# Altium schematic sheet micro-circuit-ATMEGA64M1.SchDoc: ATMega32M1 Circuit
size A4; DrawnBy: Dylan Vogel; Organization: UTAT SS; Revision: 1.1
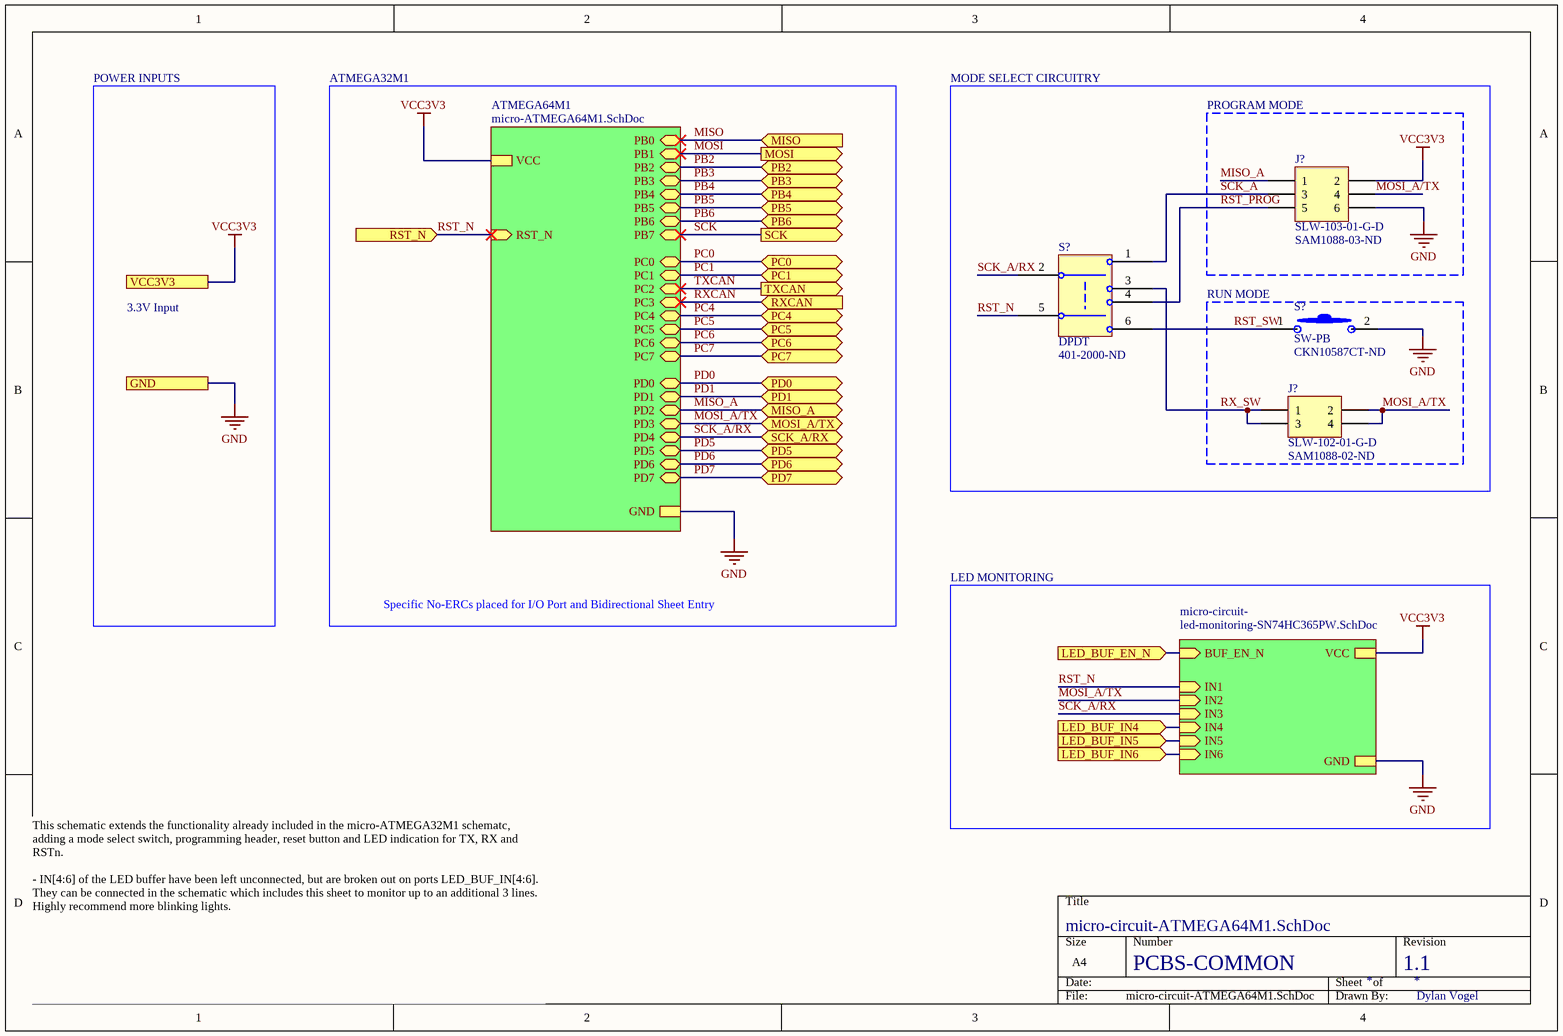
[diagram p0: micro-circuit-ATMEGA64M1.SchDoc]

## Parts
(Parts that share a designator on the sheet are numbered #1, #2 ... from top to bottom, then left to right.)
J?#1  SLW-103-01-G-D  Supplier Part Number 1: SAM1088-03-ND  [SLW-103-01-X-D]
J?#2  SLW-102-01-G-D  Supplier Part Number 1: SAM1088-02-ND  [SLW-102-01-X-D]
S?#1  DPDT  Supplier Part Number 1: 401-2000-ND  [JS202011AQN - Slide Switch]
S?#2  SW-PB  Supplier Part Number 1: CKN10587CT-ND  [PTS830GM140 SMTR LFS - Pushbutton]

## Blocks framed on the sheet
MODE SELECT CIRCUITRY: S?#1
PROGRAM MODE: J?#1
RUN MODE: J?#2 S?#2

## Sub-sheets
ATMEGA64M1 = micro-ATMEGA64M1.SchDoc: GND, PB7 (bidir), RST_N (in), VCC, PD2 (bidir), PC0 (bidir), PD1 (bidir), PD3 (bidir), PD0 (bidir), PC7 (bidir), PD5 (bidir), PC1 (bidir), PC6 (bidir), PB1 (bidir), PB6 (bidir), PC5 (bidir), PC2 (bidir), PB5 (bidir), PC3 (bidir), PD7 (bidir), PB4 (bidir), PB0 (bidir), PC4 (bidir), PD6 (bidir), PB2 (bidir), PB3 (bidir), PD4 (bidir)
micro-circuit- = led-monitoring-SN74HC365PW.SchDoc: IN4 (in), VCC, IN3 (in), IN1 (in), GND, IN2 (in), IN6 (in), IN5 (in), BUF_EN_N (in)  | LED1: GREEN LED; LED2: ORANGE LED; LED3: ORANGE LED

## Ports
GND, LED_BUF_EN_N (in), LED_BUF_IN4 (in), LED_BUF_IN5 (in), LED_BUF_IN6 (in), MISO (in), MISO_A (bidir), MOSI (out), MOSI_A/TX (bidir), PB2 (bidir), PB3 (bidir), PB4 (bidir), PB5 (bidir), PB6 (bidir), PC0 (bidir), PC1 (bidir), PC4 (bidir), PC5 (bidir), PC6 (bidir), PC7 (bidir), PD0 (bidir), PD1 (bidir), PD5 (bidir), PD6 (bidir), PD7 (bidir), RST_N (in), RXCAN (in), SCK (out), SCK_A/RX (bidir), TXCAN (out), VCC3V3

## Nets
GND: J?#1.6 S?#2.2 ; port GND, sheet micro-circuit-/GND, sheet ATMEGA64M1/GND
VCC3V3: J?#1.2 ; port VCC3V3, sheet micro-circuit-/VCC, sheet ATMEGA64M1/VCC
LED_BUF_EN_N: port LED_BUF_EN_N, sheet micro-circuit-/BUF_EN_N
LED_BUF_IN4: port LED_BUF_IN4, sheet micro-circuit-/IN4
LED_BUF_IN5: port LED_BUF_IN5, sheet micro-circuit-/IN5
LED_BUF_IN6: port LED_BUF_IN6, sheet micro-circuit-/IN6
MISO: port MISO, sheet ATMEGA64M1/PB0
MISO_A: J?#1.1 ; port MISO_A, sheet ATMEGA64M1/PD2
MOSI: port MOSI, sheet ATMEGA64M1/PB1
MOSI_A/TX: J?#1.4 J?#2.2 J?#2.4 ; port MOSI_A/TX, sheet micro-circuit-/IN2, sheet ATMEGA64M1/PD3
PB2: port PB2, sheet ATMEGA64M1/PB2
PB3: port PB3, sheet ATMEGA64M1/PB3
PB4: port PB4, sheet ATMEGA64M1/PB4
PB5: port PB5, sheet ATMEGA64M1/PB5
PB6: port PB6, sheet ATMEGA64M1/PB6
PC0: port PC0, sheet ATMEGA64M1/PC0
PC1: port PC1, sheet ATMEGA64M1/PC1
PC4: port PC4, sheet ATMEGA64M1/PC4
PC5: port PC5, sheet ATMEGA64M1/PC5
PC6: port PC6, sheet ATMEGA64M1/PC6
PC7: port PC7, sheet ATMEGA64M1/PC7
PD0: port PD0, sheet ATMEGA64M1/PD0
PD1: port PD1, sheet ATMEGA64M1/PD1
PD5: port PD5, sheet ATMEGA64M1/PD5
PD6: port PD6, sheet ATMEGA64M1/PD6
PD7: port PD7, sheet ATMEGA64M1/PD7
RST_N: S?#1.5(POLE2) ; port RST_N, sheet micro-circuit-/IN1, sheet ATMEGA64M1/RST_N
RST_PROG: J?#1.5 S?#1.4(POLE2A)
RST_SW: S?#1.6(POLE2B) S?#2.1
RX_SW: J?#2.1 J?#2.3 S?#1.3(POLE1B)
RXCAN: port RXCAN, sheet ATMEGA64M1/PC3
SCK: port SCK, sheet ATMEGA64M1/PB7
SCK_A: J?#1.3 S?#1.1(POLE1A)
SCK_A/RX: S?#1.2(POLE1) ; port SCK_A/RX, sheet micro-circuit-/IN3, sheet ATMEGA64M1/PD4
TXCAN: port TXCAN, sheet ATMEGA64M1/PC2

## Notes on the sheet
- POWER INPUTS
- ATMEGA32M1
- 3.3V Input
- LED MONITORING
- Specific No-ERCs placed for I/O Port and Bidirectional Sheet Entry
- PCBS-COMMON
- This schematic extends the functionality already included in the micro-ATMEGA32M1 schematc, adding a mode select switch, programming header, reset button and LED indication for TX, RX and RSTn.
  - IN[4:6] of the LED buffer have been left unconnected, but are broken out on ports LED_BUF_IN[4:6]. They can be connected in the schematic which includes this sheet to monitor up to an additional 3 lines. Highly recommend more blinking lights.

## Library data of the parts
J?#1 = SLW-103-01-G-D: 6 pos 100mil pitch low profile header; Supplier 1: Digi-Key
J?#2 = SLW-102-01-G-D: 4 pos 100mil pitch low profile header; Supplier 1: Digi-Key
S?#1 = DPDT Switch: DPDT Switch, customized for the pinout of the JS202011AQN switch.; Supplier 1: Digi-Key
S?#2 = Pushbutton - Low Profile: Schematic symbol for a generic 2-pin pushbutton, OFF-mom.; Supplier 1: Digi-Key